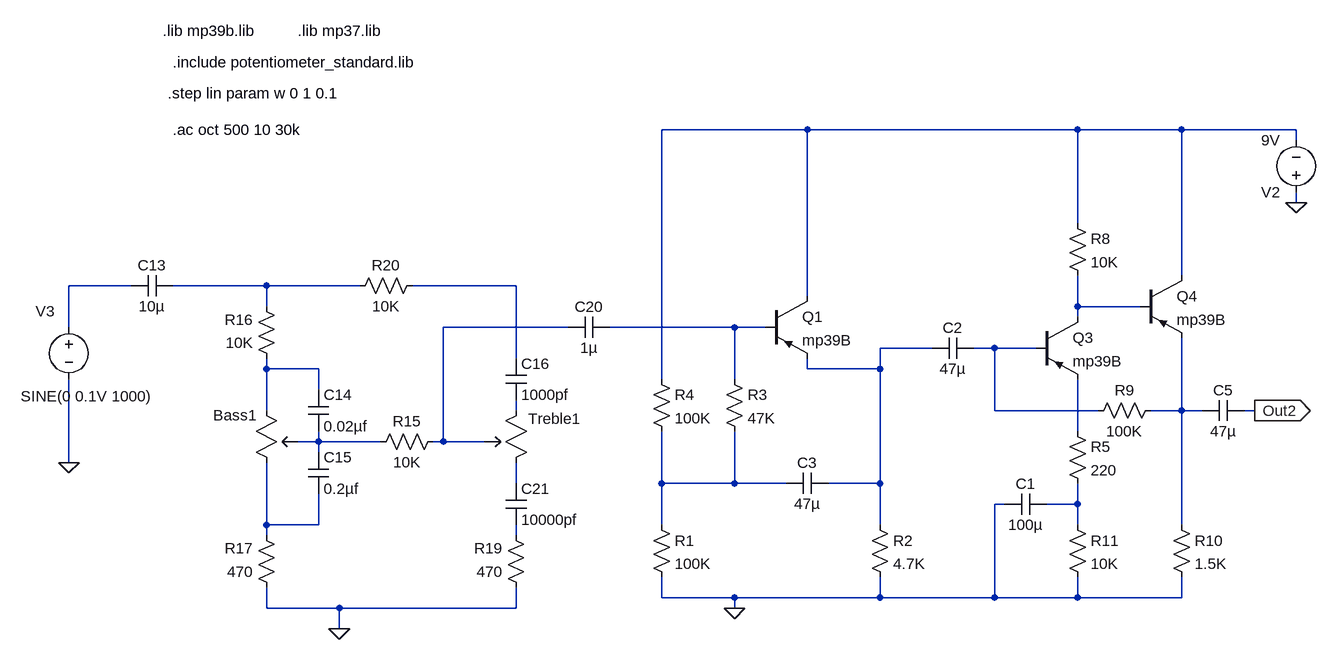
[diagram p0: schematic passive EQ.asc]
passive EQ.asc, the LTspice schematic file:
Version 4
SHEET 1 984 708
WIRE 112 -80 -112 -80
WIRE 528 -80 112 -80
WIRE 688 -80 528 -80
WIRE 864 -80 688 -80
WIRE 864 -64 864 -80
WIRE 864 32 864 16
WIRE 528 64 528 -80
WIRE 688 144 688 -80
WIRE -928 160 -1024 160
WIRE -720 160 -864 160
WIRE -576 160 -720 160
WIRE -336 160 -496 160
WIRE 112 176 112 -80
WIRE -720 192 -720 160
WIRE 528 192 528 144
WIRE 624 192 528 192
WIRE 528 208 528 192
WIRE -1024 224 -1024 160
WIRE -256 224 -448 224
WIRE 0 224 -192 224
WIRE 48 224 0 224
WIRE 304 256 224 256
WIRE 400 256 368 256
WIRE 464 256 400 256
WIRE -336 272 -336 160
WIRE -720 288 -720 272
WIRE -640 288 -720 288
WIRE 112 288 112 272
WIRE 224 288 224 256
WIRE 224 288 112 288
WIRE -112 304 -112 -80
WIRE 0 304 0 224
WIRE -640 320 -640 288
WIRE -720 352 -720 288
WIRE -336 352 -336 336
WIRE 400 352 400 256
WIRE 560 352 400 352
WIRE 688 352 688 240
WIRE 688 352 640 352
WIRE 720 352 688 352
WIRE 800 352 784 352
WIRE 528 384 528 304
WIRE -640 400 -640 384
WIRE -640 400 -672 400
WIRE -544 400 -640 400
WIRE -448 400 -448 224
WIRE -448 400 -464 400
WIRE -384 400 -448 400
WIRE -640 416 -640 400
WIRE -1024 432 -1024 304
WIRE -336 464 -336 432
WIRE -112 464 -112 384
WIRE 0 464 0 384
WIRE 0 464 -112 464
WIRE 80 464 0 464
WIRE 224 464 224 288
WIRE 224 464 144 464
WIRE 416 496 400 496
WIRE 528 496 528 464
WIRE 528 496 480 496
WIRE -720 528 -720 432
WIRE -640 528 -640 480
WIRE -640 528 -720 528
WIRE -112 528 -112 464
WIRE 224 528 224 464
WIRE 528 528 528 496
WIRE 688 528 688 352
WIRE -720 544 -720 528
WIRE -336 544 -336 528
WIRE -112 640 -112 608
WIRE 0 640 -112 640
WIRE 224 640 224 608
WIRE 224 640 0 640
WIRE 400 640 400 496
WIRE 400 640 224 640
WIRE 528 640 528 608
WIRE 528 640 400 640
WIRE 688 640 688 608
WIRE 688 640 528 640
WIRE -720 656 -720 624
WIRE -608 656 -720 656
WIRE -336 656 -336 624
WIRE -336 656 -608 656
WIRE 0 656 0 640
WIRE -608 688 -608 656
FLAG 864 32 0
FLAG 0 656 0
FLAG 800 352 Out2
IOPIN 800 352 Out
FLAG -1024 432 0
FLAG -608 688 0
SYMBOL voltage 864 32 R180
WINDOW 123 0 0 Left 2
WINDOW 39 24 -12 Left 2
SYMATTR InstName V2
SYMATTR Value 9V
SYMBOL pnp 48 176 R0
SYMATTR InstName Q1
SYMATTR Value mp39B
SYMBOL res -128 512 R0
SYMATTR InstName R1
SYMATTR Value 100K
SYMBOL cap 368 240 R90
WINDOW 0 0 32 VBottom 2
WINDOW 3 32 32 VTop 2
SYMATTR InstName C2
SYMATTR Value 47µ
SYMBOL res 208 512 R0
SYMATTR InstName R2
SYMATTR Value 4.7K
SYMBOL cap 144 448 R90
WINDOW 0 0 32 VBottom 2
WINDOW 3 32 32 VTop 2
SYMATTR InstName C3
SYMATTR Value 47µ
SYMBOL res -16 288 R0
SYMATTR InstName R3
SYMATTR Value 47K
SYMBOL res -128 288 R0
SYMATTR InstName R4
SYMATTR Value 100K
SYMBOL pnp 464 208 R0
SYMATTR InstName Q3
SYMATTR Value mp39B
SYMBOL pnp 624 144 R0
SYMATTR InstName Q4
SYMATTR Value mp39B
SYMBOL res 512 48 R0
SYMATTR InstName R8
SYMATTR Value 10K
SYMBOL res 656 336 R90
WINDOW 0 0 56 VBottom 2
WINDOW 3 32 56 VTop 2
SYMATTR InstName R9
SYMATTR Value 100K
SYMBOL res 672 512 R0
SYMATTR InstName R10
SYMATTR Value 1.5K
SYMBOL res 512 512 R0
SYMATTR InstName R11
SYMATTR Value 10K
SYMBOL cap 784 336 R90
WINDOW 0 0 32 VBottom 2
WINDOW 3 32 32 VTop 2
SYMATTR InstName C5
SYMATTR Value 47µ
SYMBOL cap 416 512 R270
WINDOW 0 32 32 VTop 2
WINDOW 3 0 32 VBottom 2
SYMATTR InstName C1
SYMATTR Value 100µ
SYMBOL voltage -1024 208 R0
WINDOW 39 -112 95 Left 2
WINDOW 3 -74 122 Left 2
WINDOW 0 -51 -9 Left 2
SYMATTR Value SINE(0 0.1V 1000)
SYMATTR InstName V3
SYMATTR Value2 AC 1
SYMBOL cap -864 144 R90
WINDOW 0 0 32 VBottom 2
WINDOW 3 32 32 VTop 2
SYMATTR InstName C13
SYMATTR Value 10µ
SYMBOL potentiometer_standard -736 336 R0
WINDOW 0 -66 23 Left 2
WINDOW 3 -201 26 Invisible 2
SYMATTR InstName Bass1
SYMATTR Value Rtot=100K wiper={w}
SYMATTR SpiceModel pot_plog
SYMATTR SpiceLine Rtap=10K tap=.5
SYMBOL potentiometer_standard -320 336 M0
WINDOW 0 -85 29 Left 2
WINDOW 3 -201 26 Invisible 2
SYMATTR InstName Treble1
SYMATTR Value Rtot=100K wiper={w}
SYMATTR SpiceModel pot_plog
SYMATTR SpiceLine Rtap=10K tap=.5
SYMBOL cap -656 320 R0
SYMATTR InstName C14
SYMATTR Value 0.02µf
SYMBOL cap -656 416 R0
SYMATTR InstName C15
SYMATTR Value 0.2µf
SYMBOL cap -352 272 R0
SYMATTR InstName C16
SYMATTR Value 1000pf
SYMBOL res -448 384 R90
WINDOW 0 0 56 VBottom 2
WINDOW 3 32 56 VTop 2
SYMATTR InstName R15
SYMATTR Value 10K
SYMBOL res -704 288 R180
WINDOW 0 36 76 Left 2
WINDOW 3 36 40 Left 2
SYMATTR InstName R16
SYMATTR Value 10K
SYMBOL res -704 640 R180
WINDOW 0 36 76 Left 2
WINDOW 3 36 40 Left 2
SYMATTR InstName R17
SYMATTR Value 470
SYMBOL cap -192 208 R90
WINDOW 0 0 32 VBottom 2
WINDOW 3 32 32 VTop 2
SYMATTR InstName C20
SYMATTR Value 1µ
SYMBOL cap -352 464 R0
SYMATTR InstName C21
SYMATTR Value 10000pf
SYMBOL res -320 640 R180
WINDOW 0 36 76 Left 2
WINDOW 3 36 40 Left 2
SYMATTR InstName R19
SYMATTR Value 470
SYMBOL res -480 144 R90
WINDOW 0 0 56 VBottom 2
WINDOW 3 32 56 VTop 2
SYMATTR InstName R20
SYMATTR Value 10K
SYMBOL res 512 368 R0
SYMATTR InstName R5
SYMATTR Value 220
TEXT -880 -232 Left 2 !.lib mp39b.lib
TEXT -672 -232 Left 2 !.lib mp37.lib
TEXT -864 -184 Left 2 !.include potentiometer_standard.lib
TEXT -872 -136 Left 2 !.step lin param w 0 1 0.1
TEXT -864 -80 Left 2 !.ac oct 500 10 30k

The netlist it stands for:
* passive EQ.asc
V2 0 N001 9V
Q1 N001 N007 N008 0 mp39B
R1 N016 0 100K
C2 N009 N008 47µ
R2 N008 0 4.7K
C3 N008 N016 47µ
R3 N007 N016 47K
R4 N001 N016 100K
Q3 N005 N009 N013 0 mp39B
Q4 N001 N005 N012 0 mp39B
R8 N001 N005 10K
R9 N012 N009 100K
R10 N012 0 1.5K
R11 N017 0 10K
C5 Out2 N012 47µ
C1 0 N017 100µ
V3 N002 0 SINE(0 0.1V 1000) AC 1
C13 N003 N002 10µ
XBass1 N010 N018 N014 pot_plog Rtot=100K wiper={w} Rtap=10K tap=.5  ; pins A B C
XTreble1 N011 N015 N006 pot_plog Rtot=100K wiper={w} Rtap=10K tap=.5  ; pins A B C
C14 N010 N014 0.02µf
C15 N014 N018 0.2µf
C16 N004 N011 1000pf
R15 N006 N014 10K
R16 N010 N003 10K
R17 0 N018 470
C20 N007 N006 1µ
C21 N015 N019 10000pf
R19 0 N019 470
R20 N004 N003 10K
R5 N013 N017 220
.model NPN NPN
.model PNP PNP
.lib standard.bjt
.lib mp39b.lib
.lib mp37.lib
.include potentiometer_standard.lib
.step lin param w 0 1 0.1
.ac oct 500 10 30k
.backanno
.end